# Altium schematic sheet Flame68.schdoc
size 750 x 347 mm
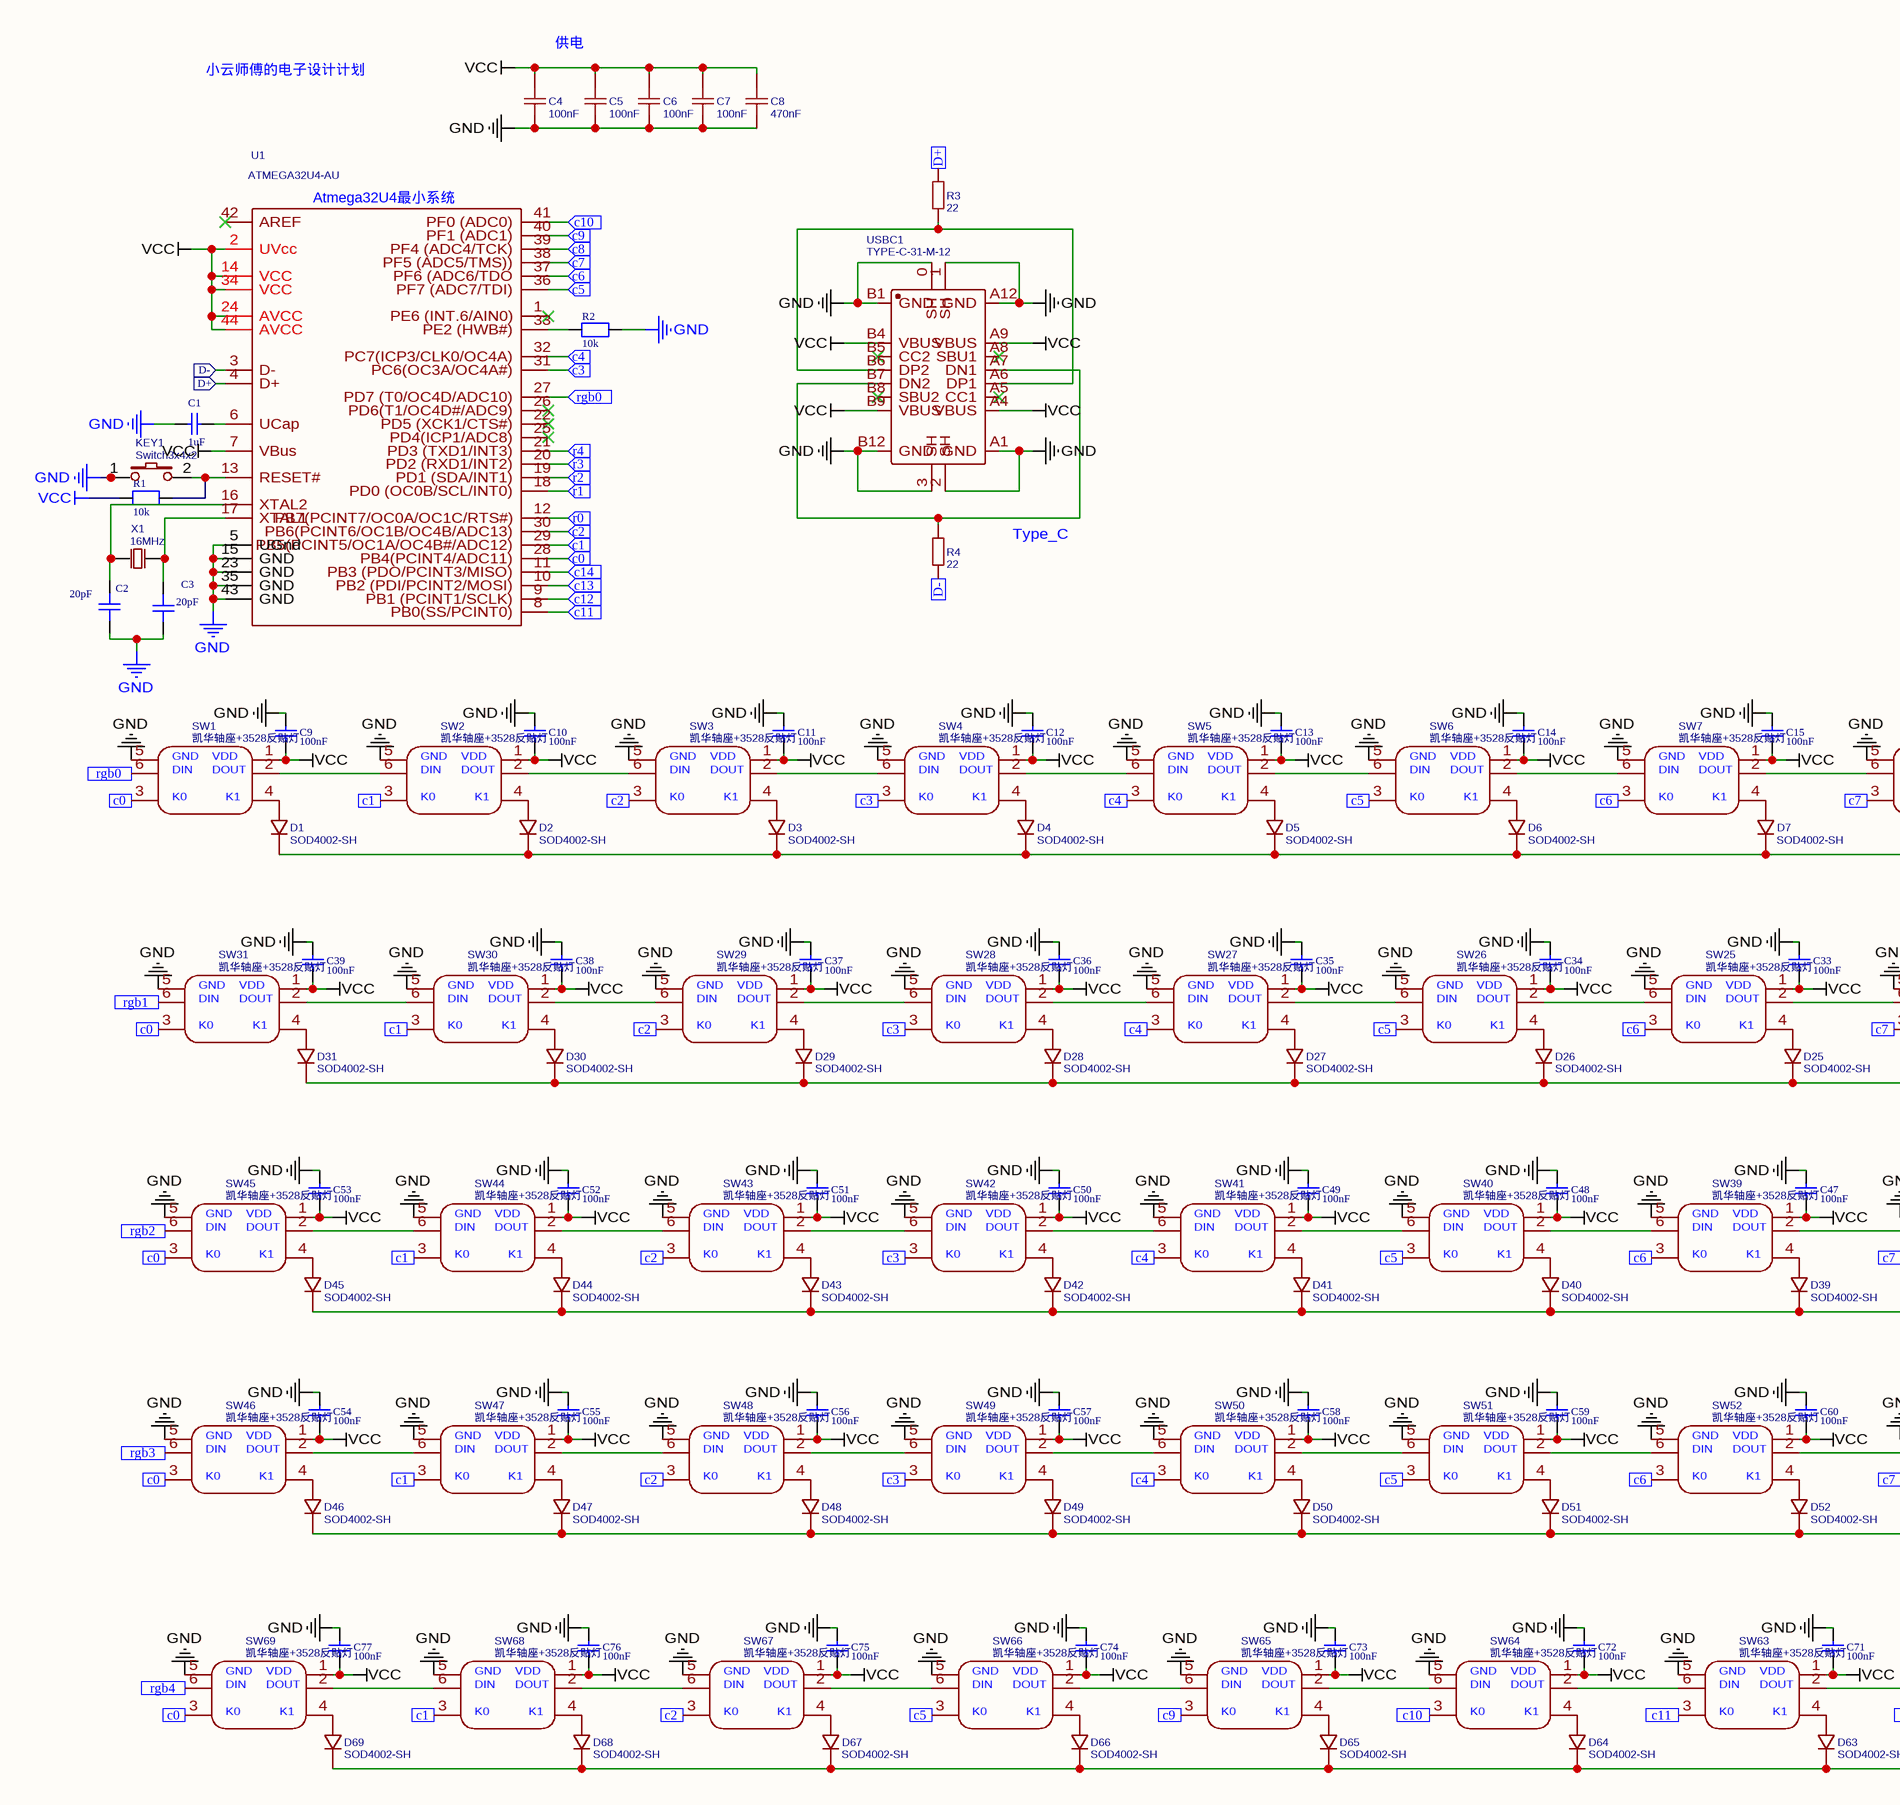
[diagram p0: Flame68.schdoc, left]
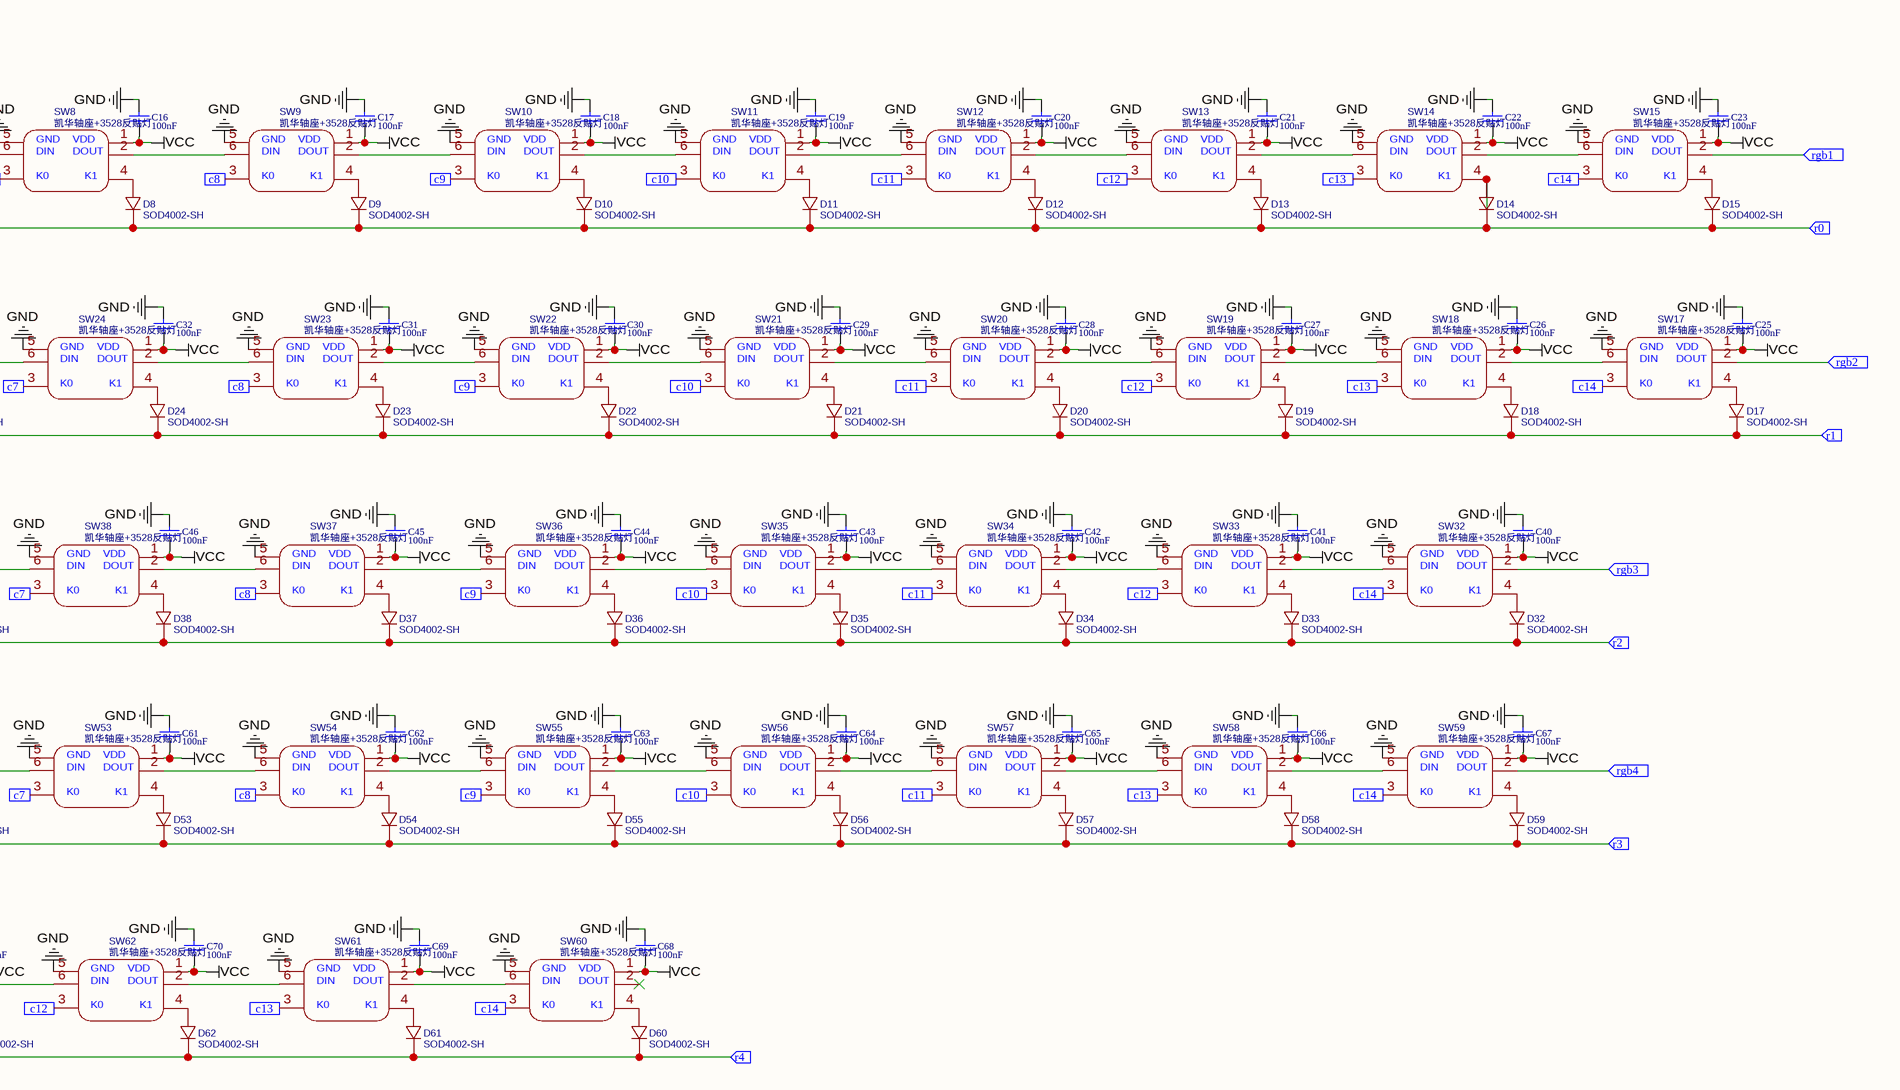
[diagram p1: Flame68.schdoc, right]

## Parts
C1  1uF  [C0805]
C2  20pF  [C0805]
C3  20pF  [C0805]
C4  100nF  [C0805]
C5  100nF  [C0805]
C6  100nF  [C0805]
C7  100nF  [C0805]
C8  470nF  [C0805]
C9  100nF  [C0805]
C10  100nF  [C0805]
C11  100nF  [C0805]
C12  100nF  [C0805]
C13  100nF  [C0805]
C14  100nF  [C0805]
C15  100nF  [C0805]
C16  100nF  [C0805]
C17  100nF  [C0805]
C18  100nF  [C0805]
C19  100nF  [C0805]
C20  100nF  [C0805]
C21  100nF  [C0805]
C22  100nF  [C0805]
C23  100nF  [C0805]
C25  100nF  [C0805]
C26  100nF  [C0805]
C27  100nF  [C0805]
C28  100nF  [C0805]
C29  100nF  [C0805]
C30  100nF  [C0805]
C31  100nF  [C0805]
C32  100nF  [C0805]
C33  100nF  [C0805]
C34  100nF  [C0805]
C35  100nF  [C0805]
C36  100nF  [C0805]
C37  100nF  [C0805]
C38  100nF  [C0805]
C39  100nF  [C0805]
C40  100nF  [C0805]
C41  100nF  [C0805]
C42  100nF  [C0805]
C43  100nF  [C0805]
C44  100nF  [C0805]
C45  100nF  [C0805]
C46  100nF  [C0805]
C47  100nF  [C0805]
C48  100nF  [C0805]
C49  100nF  [C0805]
C50  100nF  [C0805]
C51  100nF  [C0805]
C52  100nF  [C0805]
C53  100nF  [C0805]
C54  100nF  [C0805]
C55  100nF  [C0805]
C56  100nF  [C0805]
C57  100nF  [C0805]
C58  100nF  [C0805]
C59  100nF  [C0805]
C60  100nF  [C0805]
C61  100nF  [C0805]
C62  100nF  [C0805]
C63  100nF  [C0805]
C64  100nF  [C0805]
C65  100nF  [C0805]
C66  100nF  [C0805]
C67  100nF  [C0805]
C68  100nF  [C0805]
C69  100nF  [C0805]
C70  100nF  [C0805]
C71  100nF  [C0805]
C72  100nF  [C0805]
C73  100nF  [C0805]
C74  100nF  [C0805]
C75  100nF  [C0805]
C76  100nF  [C0805]
C77  100nF  [C0805]
D1  SOD4002-SH  [SOD-123F_L2.8-W1.8-LS3.7-RD]
D2  SOD4002-SH  [SOD-123F_L2.8-W1.8-LS3.7-RD]
D3  SOD4002-SH  [SOD-123F_L2.8-W1.8-LS3.7-RD]
D4  SOD4002-SH  [SOD-123F_L2.8-W1.8-LS3.7-RD]
D5  SOD4002-SH  [SOD-123F_L2.8-W1.8-LS3.7-RD]
D6  SOD4002-SH  [SOD-123F_L2.8-W1.8-LS3.7-RD]
D7  SOD4002-SH  [SOD-123F_L2.8-W1.8-LS3.7-RD]
D8  SOD4002-SH  [SOD-123F_L2.8-W1.8-LS3.7-RD]
D9  SOD4002-SH  [SOD-123F_L2.8-W1.8-LS3.7-RD]
D10  SOD4002-SH  [SOD-123F_L2.8-W1.8-LS3.7-RD]
D11  SOD4002-SH  [SOD-123F_L2.8-W1.8-LS3.7-RD]
D12  SOD4002-SH  [SOD-123F_L2.8-W1.8-LS3.7-RD]
D13  SOD4002-SH  [SOD-123F_L2.8-W1.8-LS3.7-RD]
D14  SOD4002-SH  [SOD-123F_L2.8-W1.8-LS3.7-RD]
D15  SOD4002-SH  [SOD-123F_L2.8-W1.8-LS3.7-RD]
D17  SOD4002-SH  [SOD-123F_L2.8-W1.8-LS3.7-RD]
D18  SOD4002-SH  [SOD-123F_L2.8-W1.8-LS3.7-RD]
D19  SOD4002-SH  [SOD-123F_L2.8-W1.8-LS3.7-RD]
D20  SOD4002-SH  [SOD-123F_L2.8-W1.8-LS3.7-RD]
D21  SOD4002-SH  [SOD-123F_L2.8-W1.8-LS3.7-RD]
D22  SOD4002-SH  [SOD-123F_L2.8-W1.8-LS3.7-RD]
D23  SOD4002-SH  [SOD-123F_L2.8-W1.8-LS3.7-RD]
D24  SOD4002-SH  [SOD-123F_L2.8-W1.8-LS3.7-RD]
D25  SOD4002-SH  [SOD-123F_L2.8-W1.8-LS3.7-RD]
D26  SOD4002-SH  [SOD-123F_L2.8-W1.8-LS3.7-RD]
D27  SOD4002-SH  [SOD-123F_L2.8-W1.8-LS3.7-RD]
D28  SOD4002-SH  [SOD-123F_L2.8-W1.8-LS3.7-RD]
D29  SOD4002-SH  [SOD-123F_L2.8-W1.8-LS3.7-RD]
D30  SOD4002-SH  [SOD-123F_L2.8-W1.8-LS3.7-RD]
D31  SOD4002-SH  [SOD-123F_L2.8-W1.8-LS3.7-RD]
D32  SOD4002-SH  [SOD-123F_L2.8-W1.8-LS3.7-RD]
D33  SOD4002-SH  [SOD-123F_L2.8-W1.8-LS3.7-RD]
D34  SOD4002-SH  [SOD-123F_L2.8-W1.8-LS3.7-RD]
D35  SOD4002-SH  [SOD-123F_L2.8-W1.8-LS3.7-RD]
D36  SOD4002-SH  [SOD-123F_L2.8-W1.8-LS3.7-RD]
D37  SOD4002-SH  [SOD-123F_L2.8-W1.8-LS3.7-RD]
D38  SOD4002-SH  [SOD-123F_L2.8-W1.8-LS3.7-RD]
D39  SOD4002-SH  [SOD-123F_L2.8-W1.8-LS3.7-RD]
D40  SOD4002-SH  [SOD-123F_L2.8-W1.8-LS3.7-RD]
D41  SOD4002-SH  [SOD-123F_L2.8-W1.8-LS3.7-RD]
D42  SOD4002-SH  [SOD-123F_L2.8-W1.8-LS3.7-RD]
D43  SOD4002-SH  [SOD-123F_L2.8-W1.8-LS3.7-RD]
D44  SOD4002-SH  [SOD-123F_L2.8-W1.8-LS3.7-RD]
D45  SOD4002-SH  [SOD-123F_L2.8-W1.8-LS3.7-RD]
D46  SOD4002-SH  [SOD-123F_L2.8-W1.8-LS3.7-RD]
D47  SOD4002-SH  [SOD-123F_L2.8-W1.8-LS3.7-RD]
D48  SOD4002-SH  [SOD-123F_L2.8-W1.8-LS3.7-RD]
D49  SOD4002-SH  [SOD-123F_L2.8-W1.8-LS3.7-RD]
D50  SOD4002-SH  [SOD-123F_L2.8-W1.8-LS3.7-RD]
D51  SOD4002-SH  [SOD-123F_L2.8-W1.8-LS3.7-RD]
D52  SOD4002-SH  [SOD-123F_L2.8-W1.8-LS3.7-RD]
D53  SOD4002-SH  [SOD-123F_L2.8-W1.8-LS3.7-RD]
D54  SOD4002-SH  [SOD-123F_L2.8-W1.8-LS3.7-RD]
D55  SOD4002-SH  [SOD-123F_L2.8-W1.8-LS3.7-RD]
D56  SOD4002-SH  [SOD-123F_L2.8-W1.8-LS3.7-RD]
D57  SOD4002-SH  [SOD-123F_L2.8-W1.8-LS3.7-RD]
D58  SOD4002-SH  [SOD-123F_L2.8-W1.8-LS3.7-RD]
D59  SOD4002-SH  [SOD-123F_L2.8-W1.8-LS3.7-RD]
D60  SOD4002-SH  [SOD-123F_L2.8-W1.8-LS3.7-RD]
D61  SOD4002-SH  [SOD-123F_L2.8-W1.8-LS3.7-RD]
D62  SOD4002-SH  [SOD-123F_L2.8-W1.8-LS3.7-RD]
D63  SOD4002-SH  [SOD-123F_L2.8-W1.8-LS3.7-RD]
D64  SOD4002-SH  [SOD-123F_L2.8-W1.8-LS3.7-RD]
D65  SOD4002-SH  [SOD-123F_L2.8-W1.8-LS3.7-RD]
D66  SOD4002-SH  [SOD-123F_L2.8-W1.8-LS3.7-RD]
D67  SOD4002-SH  [SOD-123F_L2.8-W1.8-LS3.7-RD]
D68  SOD4002-SH  [SOD-123F_L2.8-W1.8-LS3.7-RD]
D69  SOD4002-SH  [SOD-123F_L2.8-W1.8-LS3.7-RD]
KEY1  Switch3x4x2  [SW-SMD_L4.0-W2.9-LS5.0]
R1  10k  [R0805]
R2  10k  [R0805]
R3  22  [R0805]
R4  22  [R0805]
SW1  凯华轴座+3528反贴灯  [凯华轴座+3528反贴灯（无丝印）1]
SW2  凯华轴座+3528反贴灯  [凯华轴座+3528反贴灯（无丝印）1]
SW3  凯华轴座+3528反贴灯  [凯华轴座+3528反贴灯（无丝印）1]
SW4  凯华轴座+3528反贴灯  [凯华轴座+3528反贴灯（无丝印）1]
SW5  凯华轴座+3528反贴灯  [凯华轴座+3528反贴灯（无丝印）1]
SW6  凯华轴座+3528反贴灯  [凯华轴座+3528反贴灯（无丝印）1]
SW7  凯华轴座+3528反贴灯  [凯华轴座+3528反贴灯（无丝印）1]
SW8  凯华轴座+3528反贴灯  [凯华轴座+3528反贴灯（无丝印）1]
SW9  凯华轴座+3528反贴灯  [凯华轴座+3528反贴灯（无丝印）1]
SW10  凯华轴座+3528反贴灯  [凯华轴座+3528反贴灯（无丝印）1]
SW11  凯华轴座+3528反贴灯  [凯华轴座+3528反贴灯（无丝印）1]
SW12  凯华轴座+3528反贴灯  [凯华轴座+3528反贴灯（无丝印）1]
SW13  凯华轴座+3528反贴灯  [凯华轴座+3528反贴灯（无丝印）1]
SW14  凯华轴座+3528反贴灯  [凯华轴座+3528反贴灯（无丝印）1]
SW15  凯华轴座+3528反贴灯  [凯华轴座+3528反贴灯（无丝印）1]
SW17  凯华轴座+3528反贴灯  [凯华轴座+3528反贴灯（无丝印）1]
SW18  凯华轴座+3528反贴灯  [凯华轴座+3528反贴灯（无丝印）1]
SW19  凯华轴座+3528反贴灯  [凯华轴座+3528反贴灯（无丝印）1]
SW20  凯华轴座+3528反贴灯  [凯华轴座+3528反贴灯（无丝印）1]
SW21  凯华轴座+3528反贴灯  [凯华轴座+3528反贴灯（无丝印）1]
SW22  凯华轴座+3528反贴灯  [凯华轴座+3528反贴灯（无丝印）1]
SW23  凯华轴座+3528反贴灯  [凯华轴座+3528反贴灯（无丝印）1]
SW24  凯华轴座+3528反贴灯  [凯华轴座+3528反贴灯（无丝印）1]
SW25  凯华轴座+3528反贴灯  [凯华轴座+3528反贴灯（无丝印）1]
SW26  凯华轴座+3528反贴灯  [凯华轴座+3528反贴灯（无丝印）1]
SW27  凯华轴座+3528反贴灯  [凯华轴座+3528反贴灯（无丝印）1]
SW28  凯华轴座+3528反贴灯  [凯华轴座+3528反贴灯（无丝印）1]
SW29  凯华轴座+3528反贴灯  [凯华轴座+3528反贴灯（无丝印）1]
SW30  凯华轴座+3528反贴灯  [凯华轴座+3528反贴灯（无丝印）1]
SW31  凯华轴座+3528反贴灯  [凯华轴座+3528反贴灯（无丝印）1]
SW32  凯华轴座+3528反贴灯  [凯华轴座+3528反贴灯（无丝印）1]
SW33  凯华轴座+3528反贴灯  [凯华轴座+3528反贴灯（无丝印）1]
SW34  凯华轴座+3528反贴灯  [凯华轴座+3528反贴灯（无丝印）1]
SW35  凯华轴座+3528反贴灯  [凯华轴座+3528反贴灯（无丝印）1]
SW36  凯华轴座+3528反贴灯  [凯华轴座+3528反贴灯（无丝印）1]
SW37  凯华轴座+3528反贴灯  [凯华轴座+3528反贴灯（无丝印）1]
SW38  凯华轴座+3528反贴灯  [凯华轴座+3528反贴灯（无丝印）1]
SW39  凯华轴座+3528反贴灯  [凯华轴座+3528反贴灯（无丝印）1]
SW40  凯华轴座+3528反贴灯  [凯华轴座+3528反贴灯（无丝印）1]
SW41  凯华轴座+3528反贴灯  [凯华轴座+3528反贴灯（无丝印）1]
SW42  凯华轴座+3528反贴灯  [凯华轴座+3528反贴灯（无丝印）1]
SW43  凯华轴座+3528反贴灯  [凯华轴座+3528反贴灯（无丝印）1]
SW44  凯华轴座+3528反贴灯  [凯华轴座+3528反贴灯（无丝印）1]
SW45  凯华轴座+3528反贴灯  [凯华轴座+3528反贴灯（无丝印）1]
SW46  凯华轴座+3528反贴灯  [凯华轴座+3528反贴灯（无丝印）1]
SW47  凯华轴座+3528反贴灯  [凯华轴座+3528反贴灯（无丝印）1]
SW48  凯华轴座+3528反贴灯  [凯华轴座+3528反贴灯（无丝印）1]
SW49  凯华轴座+3528反贴灯  [凯华轴座+3528反贴灯（无丝印）1]
SW50  凯华轴座+3528反贴灯  [凯华轴座+3528反贴灯（无丝印）1]
SW51  凯华轴座+3528反贴灯  [凯华轴座+3528反贴灯（无丝印）1]
SW52  凯华轴座+3528反贴灯  [凯华轴座+3528反贴灯（无丝印）1]
SW53  凯华轴座+3528反贴灯  [凯华轴座+3528反贴灯（无丝印）1]
SW54  凯华轴座+3528反贴灯  [凯华轴座+3528反贴灯（无丝印）1]
SW55  凯华轴座+3528反贴灯  [凯华轴座+3528反贴灯（无丝印）1]
SW56  凯华轴座+3528反贴灯  [凯华轴座+3528反贴灯（无丝印）1]
SW57  凯华轴座+3528反贴灯  [凯华轴座+3528反贴灯（无丝印）1]
SW58  凯华轴座+3528反贴灯  [凯华轴座+3528反贴灯（无丝印）1]
SW59  凯华轴座+3528反贴灯  [凯华轴座+3528反贴灯（无丝印）1]
SW60  凯华轴座+3528反贴灯  [凯华轴座+3528反贴灯（无丝印）1]
SW61  凯华轴座+3528反贴灯  [凯华轴座+3528反贴灯（无丝印）1]
SW62  凯华轴座+3528反贴灯  [凯华轴座+3528反贴灯（无丝印）1]
SW63  凯华轴座+3528反贴灯  [凯华轴座+3528反贴灯（无丝印）1]
SW64  凯华轴座+3528反贴灯  [凯华轴座+3528反贴灯（无丝印）1]
SW65  凯华轴座+3528反贴灯  [凯华轴座+3528反贴灯（无丝印）1]
SW66  凯华轴座+3528反贴灯  [凯华轴座+3528反贴灯（无丝印）1]
SW67  凯华轴座+3528反贴灯  [凯华轴座+3528反贴灯（无丝印）1]
SW68  凯华轴座+3528反贴灯  [凯华轴座+3528反贴灯（无丝印）1]
SW69  凯华轴座+3528反贴灯  [凯华轴座+3528反贴灯（无丝印）1]
U1  ATMEGA32U4-AU  [QFP-44_L10.0-W10.0-P0.80-LS13.2-BL]
USBC1  TYPE-C-31-M-12  [USB-C_SMD-TYPE-C-31-M-12]
X1  16MHz  [OSC-SMD_2P-L5.0-W3.2]

## Ports
c0 (in), c1 (in), c2 (in), c3 (in), c4 (in), c5 (in), c6 (in), c7 (in), c8 (in), c9 (in), c10 (in), c11 (in), c12 (in), c13 (in), c14 (in), D+ (in), D- (in), r0 (in), r1 (in), r2 (in), r3 (in), r4 (in), rgb0 (in), rgb1 (in), rgb2 (in), rgb3 (in), rgb4 (in)

## Nets
GND: C1.1 C2.2 C3.2 C4.1 C5.1 C6.1 C7.1 C8.1 C9.2 C10.2 C11.2 C12.2 C13.2 C14.2 C15.2 C16.2 C17.2 C18.2 C19.2 C20.2 C21.2 C22.2 C23.2 C25.2 C26.2 C27.2 C28.2 C29.2 C30.2 C31.2 C32.2 C33.2 C34.2 C35.2 C36.2 C37.2 C38.2 C39.2 C40.2 C41.2 C42.2 C43.2 C44.2 C45.2 C46.2 C47.2 C48.2 C49.2 C50.2 C51.2 C52.2 C53.2 C54.2 C55.2 C56.2 C57.2 C58.2 C59.2 C60.2 C61.2 C62.2 C63.2 C64.2 C65.2 C66.2 C67.2 C68.2 C69.2 C70.2 C71.2 C72.2 C73.2 C74.2 C75.2 C76.2 C77.2 KEY1.1 R2.2 SW1.5 SW2.5 SW3.5 SW4.5 SW5.5 SW6.5 SW7.5 SW8.5 SW9.5 SW10.5 SW11.5 SW12.5 SW13.5 SW14.5 SW15.5 SW17.5 SW18.5 SW19.5 SW20.5 SW21.5 SW22.5 SW23.5 SW24.5 SW25.5 SW26.5 SW27.5 SW28.5 SW29.5 SW30.5 SW31.5 SW32.5 SW33.5 SW34.5 SW35.5 SW36.5 SW37.5 SW38.5 SW39.5 SW40.5 SW41.5 SW42.5 SW43.5 SW44.5 SW45.5 SW46.5 SW47.5 SW48.5 SW49.5 SW50.5 SW51.5 SW52.5 SW53.5 SW54.5 SW55.5 SW56.5 SW57.5 SW58.5 SW59.5 SW60.5 SW61.5 SW62.5 SW63.5 SW64.5 SW65.5 SW66.5 SW67.5 SW68.5 SW69.5 U1.5(UGnd) U1.15(GND) U1.23(GND) U1.35(GND) U1.43(GND) USBC1.0(SH) USBC1.1(SH) USBC1.2(SH) USBC1.3(SH) USBC1.A1(GND) USBC1.A12(GND) USBC1.B1(GND) USBC1.B12(GND)
VCC: C4.2 C5.2 C6.2 C7.2 C8.2 C9.1 C10.1 C11.1 C12.1 C13.1 C14.1 C15.1 C16.1 C17.1 C18.1 C19.1 C20.1 C21.1 C22.1 C23.1 C25.1 C26.1 C27.1 C28.1 C29.1 C30.1 C31.1 C32.1 C33.1 C34.1 C35.1 C36.1 C37.1 C38.1 C39.1 C40.1 C41.1 C42.1 C43.1 C44.1 C45.1 C46.1 C47.1 C48.1 C49.1 C50.1 C51.1 C52.1 C53.1 C54.1 C55.1 C56.1 C57.1 C58.1 C59.1 C60.1 C61.1 C62.1 C63.1 C64.1 C65.1 C66.1 C67.1 C68.1 C69.1 C70.1 C71.1 C72.1 C73.1 C74.1 C75.1 C76.1 C77.1 R1.1 SW1.1 SW2.1 SW3.1 SW4.1 SW5.1 SW6.1 SW7.1 SW8.1 SW9.1 SW10.1 SW11.1 SW12.1 SW13.1 SW14.1 SW15.1 SW17.1 SW18.1 SW19.1 SW20.1 SW21.1 SW22.1 SW23.1 SW24.1 SW25.1 SW26.1 SW27.1 SW28.1 SW29.1 SW30.1 SW31.1 SW32.1 SW33.1 SW34.1 SW35.1 SW36.1 SW37.1 SW38.1 SW39.1 SW40.1 SW41.1 SW42.1 SW43.1 SW44.1 SW45.1 SW46.1 SW47.1 SW48.1 SW49.1 SW50.1 SW51.1 SW52.1 SW53.1 SW54.1 SW55.1 SW56.1 SW57.1 SW58.1 SW59.1 SW60.1 SW61.1 SW62.1 SW63.1 SW64.1 SW65.1 SW66.1 SW67.1 SW68.1 SW69.1 U1.2(UVcc) U1.7(VBus) U1.14(VCC) U1.24(AVCC) U1.34(VCC) U1.44(AVCC) USBC1.A4(VBUS) USBC1.A9(VBUS) USBC1.B4(VBUS) USBC1.B9(VBUS)
c0: SW1.3 SW31.3 SW45.3 SW46.3 SW69.3 U1.28(PB4(PCINT4/ADC11)) ; port c0
c1: SW2.3 SW30.3 SW44.3 SW47.3 SW68.3 U1.29(PB5(PCINT5/OC1A/OC4B#/ADC12)) ; port c1
c2: SW3.3 SW29.3 SW43.3 SW48.3 SW67.3 U1.30(PB6(PCINT6/OC1B/OC4B/ADC13)) ; port c2
c3: SW4.3 SW28.3 SW42.3 SW49.3 U1.31(PC6(OC3A/OC4A#)) ; port c3
c4: SW5.3 SW27.3 SW41.3 SW50.3 U1.32(PC7(ICP3/CLK0/OC4A)) ; port c4
c5: SW6.3 SW26.3 SW40.3 SW51.3 SW66.3 U1.36(PF7_(ADC7/TDI)) ; port c5
c6: SW7.3 SW25.3 SW39.3 SW52.3 U1.37(PF6_(ADC6/TDO) ; port c6
c7: SW8.3 SW24.3 SW38.3 SW53.3 U1.38(PF5_(ADC5/TMS))) ; port c7
c8: SW9.3 SW23.3 SW37.3 SW54.3 U1.39(PF4_(ADC4/TCK)) ; port c8
c9: SW10.3 SW22.3 SW36.3 SW55.3 SW65.3 U1.40(PF1_(ADC1)) ; port c9
c10: SW11.3 SW21.3 SW35.3 SW56.3 SW64.3 U1.41(PF0_(ADC0)) ; port c10
c11: SW12.3 SW20.3 SW34.3 SW57.3 SW63.3 U1.8(PB0(SS/PCINT0)) ; port c11
c12: SW13.3 SW19.3 SW33.3 SW62.3 U1.9(PB1_(PCINT1/SCLK)) ; port c12
c13: SW14.3 SW18.3 SW58.3 SW61.3 U1.10(PB2_(PDI/PCINT2/MOSI)) ; port c13
c14: SW15.3 SW17.3 SW32.3 SW59.3 SW60.3 U1.11(PB3_(PDO/PCINT3/MISO)) ; port c14
D+: R3.2 U1.4(D+) ; port D+
D-: R4.1 U1.3(D-) ; port D-
r0: D1.1(K) D2.1(K) D3.1(K) D4.1(K) D5.1(K) D6.1(K) D7.1(K) D8.1(K) D9.1(K) D10.1(K) D11.1(K) D12.1(K) D13.1(K) D14.1(K) D15.1(K) U1.12(PB7(PCINT7/OC0A/OC1C/RTS#)) ; port r0
r1: D17.1(K) D18.1(K) D19.1(K) D20.1(K) D21.1(K) D22.1(K) D23.1(K) D24.1(K) D25.1(K) D26.1(K) D27.1(K) D28.1(K) D29.1(K) D30.1(K) D31.1(K) U1.18(PD0_(OC0B/SCL/INT0)) ; port r1
r2: D32.1(K) D33.1(K) D34.1(K) D35.1(K) D36.1(K) D37.1(K) D38.1(K) D39.1(K) D40.1(K) D41.1(K) D42.1(K) D43.1(K) D44.1(K) D45.1(K) U1.19(PD1_(SDA/INT1)) ; port r2
r3: D46.1(K) D47.1(K) D48.1(K) D49.1(K) D50.1(K) D51.1(K) D52.1(K) D53.1(K) D54.1(K) D55.1(K) D56.1(K) D57.1(K) D58.1(K) D59.1(K) U1.20(PD2_(RXD1/INT2)) ; port r3
r4: D60.1(K) D61.1(K) D62.1(K) D63.1(K) D64.1(K) D65.1(K) D66.1(K) D67.1(K) D68.1(K) D69.1(K) U1.21(PD3_(TXD1/INT3)) ; port r4
rgb0: SW1.6 U1.27(PD7_(T0/OC4D/ADC10)) ; port rgb0
rgb1: SW15.2 SW31.6 ; port rgb1
rgb2: SW17.2 SW45.6 ; port rgb2
rgb3: SW32.2 SW46.6 ; port rgb3
rgb4: SW59.2 SW69.6 ; port rgb4
NetC1_2: C1.2 U1.6(UCap)
NetC2_1: C2.1 U1.16(XTAL2) X1.2(OSC2)
NetC3_1: C3.1 U1.17(XTAL1) X1.1(OSC1)
NetD1_2: D1.2(A) SW1.4
NetD2_2: D2.2(A) SW2.4
NetD3_2: D3.2(A) SW3.4
NetD4_2: D4.2(A) SW4.4
NetD5_2: D5.2(A) SW5.4
NetD6_2: D6.2(A) SW6.4
NetD7_2: D7.2(A) SW7.4
NetD8_2: D8.2(A) SW8.4
NetD9_2: D9.2(A) SW9.4
NetD10_2: D10.2(A) SW10.4
NetD11_2: D11.2(A) SW11.4
NetD12_2: D12.2(A) SW12.4
NetD13_2: D13.2(A) SW13.4
NetD14_2: D14.2(A) SW14.4
NetD15_2: D15.2(A) SW15.4
NetD17_2: D17.2(A) SW17.4
NetD18_2: D18.2(A) SW18.4
NetD19_2: D19.2(A) SW19.4
NetD20_2: D20.2(A) SW20.4
NetD21_2: D21.2(A) SW21.4
NetD22_2: D22.2(A) SW22.4
NetD23_2: D23.2(A) SW23.4
NetD24_2: D24.2(A) SW24.4
NetD25_2: D25.2(A) SW25.4
NetD26_2: D26.2(A) SW26.4
NetD27_2: D27.2(A) SW27.4
NetD28_2: D28.2(A) SW28.4
NetD29_2: D29.2(A) SW29.4
NetD30_2: D30.2(A) SW30.4
NetD31_2: D31.2(A) SW31.4
NetD32_2: D32.2(A) SW32.4
NetD33_2: D33.2(A) SW33.4
NetD34_2: D34.2(A) SW34.4
NetD35_2: D35.2(A) SW35.4
NetD36_2: D36.2(A) SW36.4
NetD37_2: D37.2(A) SW37.4
NetD38_2: D38.2(A) SW38.4
NetD39_2: D39.2(A) SW39.4
NetD40_2: D40.2(A) SW40.4
NetD41_2: D41.2(A) SW41.4
NetD42_2: D42.2(A) SW42.4
NetD43_2: D43.2(A) SW43.4
NetD44_2: D44.2(A) SW44.4
NetD45_2: D45.2(A) SW45.4
NetD46_2: D46.2(A) SW46.4
NetD47_2: D47.2(A) SW47.4
NetD48_2: D48.2(A) SW48.4
NetD49_2: D49.2(A) SW49.4
NetD50_2: D50.2(A) SW50.4
NetD51_2: D51.2(A) SW51.4
NetD52_2: D52.2(A) SW52.4
NetD53_2: D53.2(A) SW53.4
NetD54_2: D54.2(A) SW54.4
NetD55_2: D55.2(A) SW55.4
NetD56_2: D56.2(A) SW56.4
NetD57_2: D57.2(A) SW57.4
NetD58_2: D58.2(A) SW58.4
NetD59_2: D59.2(A) SW59.4
NetD60_2: D60.2(A) SW60.4
NetD61_2: D61.2(A) SW61.4
NetD62_2: D62.2(A) SW62.4
NetD63_2: D63.2(A) SW63.4
NetD64_2: D64.2(A) SW64.4
NetD65_2: D65.2(A) SW65.4
NetD66_2: D66.2(A) SW66.4
NetD67_2: D67.2(A) SW67.4
NetD68_2: D68.2(A) SW68.4
NetD69_2: D69.2(A) SW69.4
NetKEY1_2: KEY1.2 R1.2 U1.13(RESET#)
NetR2_1: R2.1 U1.33(PE2_(HWB#))
NetR3_1: R3.1 USBC1.A6(DP1) USBC1.B6(DP2)
NetR4_2: R4.2 USBC1.A7(DN1) USBC1.B7(DN2)
NetSW1_2: SW1.2 SW2.6
NetSW2_2: SW2.2 SW3.6
NetSW3_2: SW3.2 SW4.6
NetSW4_2: SW4.2 SW5.6
NetSW5_2: SW5.2 SW6.6
NetSW6_2: SW6.2 SW7.6
NetSW7_2: SW7.2 SW8.6
NetSW8_2: SW8.2 SW9.6
NetSW9_2: SW9.2 SW10.6
NetSW10_2: SW10.2 SW11.6
NetSW11_2: SW11.2 SW12.6
NetSW12_2: SW12.2 SW13.6
NetSW13_2: SW13.2 SW14.6
NetSW14_2: SW14.2 SW15.6
NetSW17_6: SW17.6 SW18.2
NetSW18_6: SW18.6 SW19.2
NetSW19_6: SW19.6 SW20.2
NetSW20_6: SW20.6 SW21.2
NetSW21_6: SW21.6 SW22.2
NetSW22_6: SW22.6 SW23.2
NetSW23_6: SW23.6 SW24.2
NetSW24_6: SW24.6 SW25.2
NetSW25_6: SW25.6 SW26.2
NetSW26_6: SW26.6 SW27.2
NetSW27_6: SW27.6 SW28.2
NetSW28_6: SW28.6 SW29.2
NetSW29_6: SW29.6 SW30.2
NetSW30_6: SW30.6 SW31.2
NetSW32_6: SW32.6 SW33.2
NetSW33_6: SW33.6 SW34.2
NetSW34_6: SW34.6 SW35.2
NetSW35_6: SW35.6 SW36.2
NetSW36_6: SW36.6 SW37.2
NetSW37_6: SW37.6 SW38.2
NetSW38_6: SW38.6 SW39.2
NetSW39_6: SW39.6 SW40.2
NetSW40_6: SW40.6 SW41.2
NetSW41_6: SW41.6 SW42.2
NetSW42_6: SW42.6 SW43.2
NetSW43_6: SW43.6 SW44.2
NetSW44_6: SW44.6 SW45.2
NetSW46_2: SW46.2 SW47.6
NetSW47_2: SW47.2 SW48.6
NetSW48_2: SW48.2 SW49.6
NetSW49_2: SW49.2 SW50.6
NetSW50_2: SW50.2 SW51.6
NetSW51_2: SW51.2 SW52.6
NetSW52_2: SW52.2 SW53.6
NetSW53_2: SW53.2 SW54.6
NetSW54_2: SW54.2 SW55.6
NetSW55_2: SW55.2 SW56.6
NetSW56_2: SW56.2 SW57.6
NetSW57_2: SW57.2 SW58.6
NetSW58_2: SW58.2 SW59.6
NetSW60_6: SW60.6 SW61.2
NetSW61_6: SW61.6 SW62.2
NetSW62_6: SW62.6 SW63.2
NetSW63_6: SW63.6 SW64.2
NetSW64_6: SW64.6 SW65.2
NetSW65_6: SW65.6 SW66.2
NetSW66_6: SW66.6 SW67.2
NetSW67_6: SW67.6 SW68.2
NetSW68_6: SW68.6 SW69.2

Not connected (* = marked no-connect by the designer): SW60 2(6)*; U1 1(PE6_(INT.6/AIN0))* 22(PD5_(XCK1/CTS#))* 25(PD4(ICP1/ADC8))* 26(PD6(T1/OC4D#/ADC9))* 42(AREF)*; USBC1 A5(CC1)* A8(SBU1)* B5(CC2)* B8(SBU2)*

## Notes on the sheet
- 小云师傅的电子设计计划
- 供电
- (near U1) Atmega32U4最小系统
- Type_C
- (near SW31) DIN
- (in symbol 凯华轴座+3528反贴灯) GND; VDD; DIN; DOUT; K0; K1

## Library data of the parts
C1 = 1uF: Manufacturer: SAMSUNG(三星); Symbol: CL21F105ZOFNNNE; Add into BOM: yes; Tolerance: -20%+80%; Voltage Rated: 16V; Temperature Coefficient: Y5V; Description: 容值:1uF;精度:-20%+80%;额定电压:16V;材质(温度系数):Y5V;; Device: CL21F105ZOFNNNE; LCSC Part Name: 1uF -20%+80% 16V; Supplier Part: C16834; Manufacturer Part: CL21F105ZOFNNNE; Supplier Footprint: 0805; Datasheet: https://atta.szlcsc.com/upload/public/pdf/source/20160103/1457707690495.pdf; Supplier: LCSC; Convert to PCB: yes
C2 C3 = 20pF: Manufacturer: YAGEO(国巨); Symbol: CC0805JRNPO0BN200; Add into BOM: yes; Tolerance: ±5%; Voltage Rated: 100V; Temperature Coefficient: NP0; Description: 容值:20pF;精度:±5%;额定电压:100V;材质(温度系数):NP0;; Device: CC0805JRNPO0BN200; LCSC Part Name: 20pF ±5% 100V; Supplier Part: C326845; Manufacturer Part: CC0805JRNPO0BN200; Supplier Footprint: 0805; Datasheet: https://atta.szlcsc.com/upload/public/pdf/source/20181031/C326845_2B275F0378EE0388D9F10982CD307F89.pdf; Supplier: LCSC; Convert to PCB: yes
C4-C7 = 100nF: BOM_Manufacturer: muRata(村田); BOM_Manufacturer Part: GRM21BR60G107ME15L; nameAlias: Capacitance; Contributor: LCSC; BOM_Supplier: LCSC; BOM_Supplier Part: C437555; BOM_JLCPCB Part Class: Extended Part; spicePre: C; spiceSymbolName: GRM21BR60G107ME15L
C8 = 470nF: BOM_Manufacturer: KEMET(基美); BOM_Manufacturer Part: C0805X474K4RAC7800; nameAlias: Capacitance; Contributor: LCSC; BOM_Supplier: LCSC; BOM_Supplier Part: C599989; BOM_JLCPCB Part Class: Extended Part; spicePre: C; spiceSymbolName: C0805X474K4RAC7800
C9-C23 C25-C77 = 100nF: Manufacturer: SAMSUNG(三星); Symbol: CL21F105ZOFNNNE; Add into BOM: yes; Tolerance: -20%+80%; Voltage Rated: 16V; Temperature Coefficient: Y5V; Description: 容值:1uF;精度:-20%+80%;额定电压:16V;材质(温度系数):Y5V;; Device: CL21F105ZOFNNNE; LCSC Part Name: 1uF -20%+80% 16V; Supplier Part: C16834; Manufacturer Part: CL21F105ZOFNNNE; Supplier Footprint: 0805; Datasheet: https://atta.szlcsc.com/upload/public/pdf/source/20160103/1457707690495.pdf; Supplier: LCSC; Convert to PCB: yes
D1-D15 D17-D69 = SOD4002-SH: BOM_Manufacturer: LRC(乐山无线电); Contributor: LCSC; BOM_Supplier: LCSC; BOM_Manufacturer Part: SOD4002-SH; BOM_Supplier Part: C154996; BOM_JLCPCB Part Class: Extended Part; spicePre: D; spiceSymbolName: SOD4002-SH
KEY1 = Switch3x4x2: BOM_Manufacturer: ReliaPro; BOM_Supplier: LCSC; BOM_Manufacturer Part: Switch3x4x2; BOM_Supplier Part: C26638; BOM_JLCPCB Part Class: Extended Part; spicePre: K; spiceSymbolName: Switch3x4x2
R1 R2 = 10k: Manufacturer: Viking(光颉); Symbol: AR05DTD1002; Add into BOM: yes; Tolerance: ±0.5%; Temperature Coefficient: ±50ppm/; Description: 阻值:10k;精度:±0.5%;温度系数:±50ppm/;; Device: AR05DTD1002; LCSC Part Name: 10k ±0.5%; Supplier Part: C5120082; Manufacturer Part: AR05DTD1002; Supplier Footprint: 0805; Datasheet: https://atta.szlcsc.comnull; Supplier: LCSC; Convert to PCB: yes
R3 R4 = 22: BOM_Manufacturer: YAGEO(国巨); BOM_Manufacturer Part: SR0805FR-0722RL; nameAlias: Resistance (Ohms); Contributor: LCSC; Resistance: 22Ω; BOM_Supplier: LCSC; BOM_Supplier Part: C326853; BOM_JLCPCB Part Class: Extended Part; spicePre: R; spiceSymbolName: SR0805FR-0722RL
SW1-SW15 SW17-SW69 = 凯华轴座+3528反贴灯: Contributor: gvhgvj; spicePre: S; spiceSymbolName: 凯华轴座+3528反贴灯
U1 = ATMEGA32U4-AU: BOM_Manufacturer: MICROCHIP(美国微芯); BOM_Supplier: LCSC; BOM_Manufacturer Part: ATMEGA32U4-AU; BOM_Supplier Part: C44854; BOM_JLCPCB Part Class: Extended Part; spicePre: U; spiceSymbolName: ATMEGA32U4-AU
USBC1 = TYPE-C-31-M-12: BOM_Manufacturer: 韩国韩荣; Contributor: LCSC; BOM_Supplier: LCSC; BOM_Supplier Part: C165948; BOM_Manufacturer Part: TYPE-C-31-M-12; BOM_JLCPCB Part Class: Extended Part; spicePre: U; spiceSymbolName: TYPE-C-31-M-12
X1 = 16MHz: BOM_Manufacturer: YXC; BOM_Manufacturer Part: X503216MSD2GI; nameAlias: Frequency; BOM_Supplier: LCSC; BOM_Supplier Part: C73355; BOM_JLCPCB Part Class: Extended Part; spicePre: X; spiceSymbolName: X503216MSD2GI